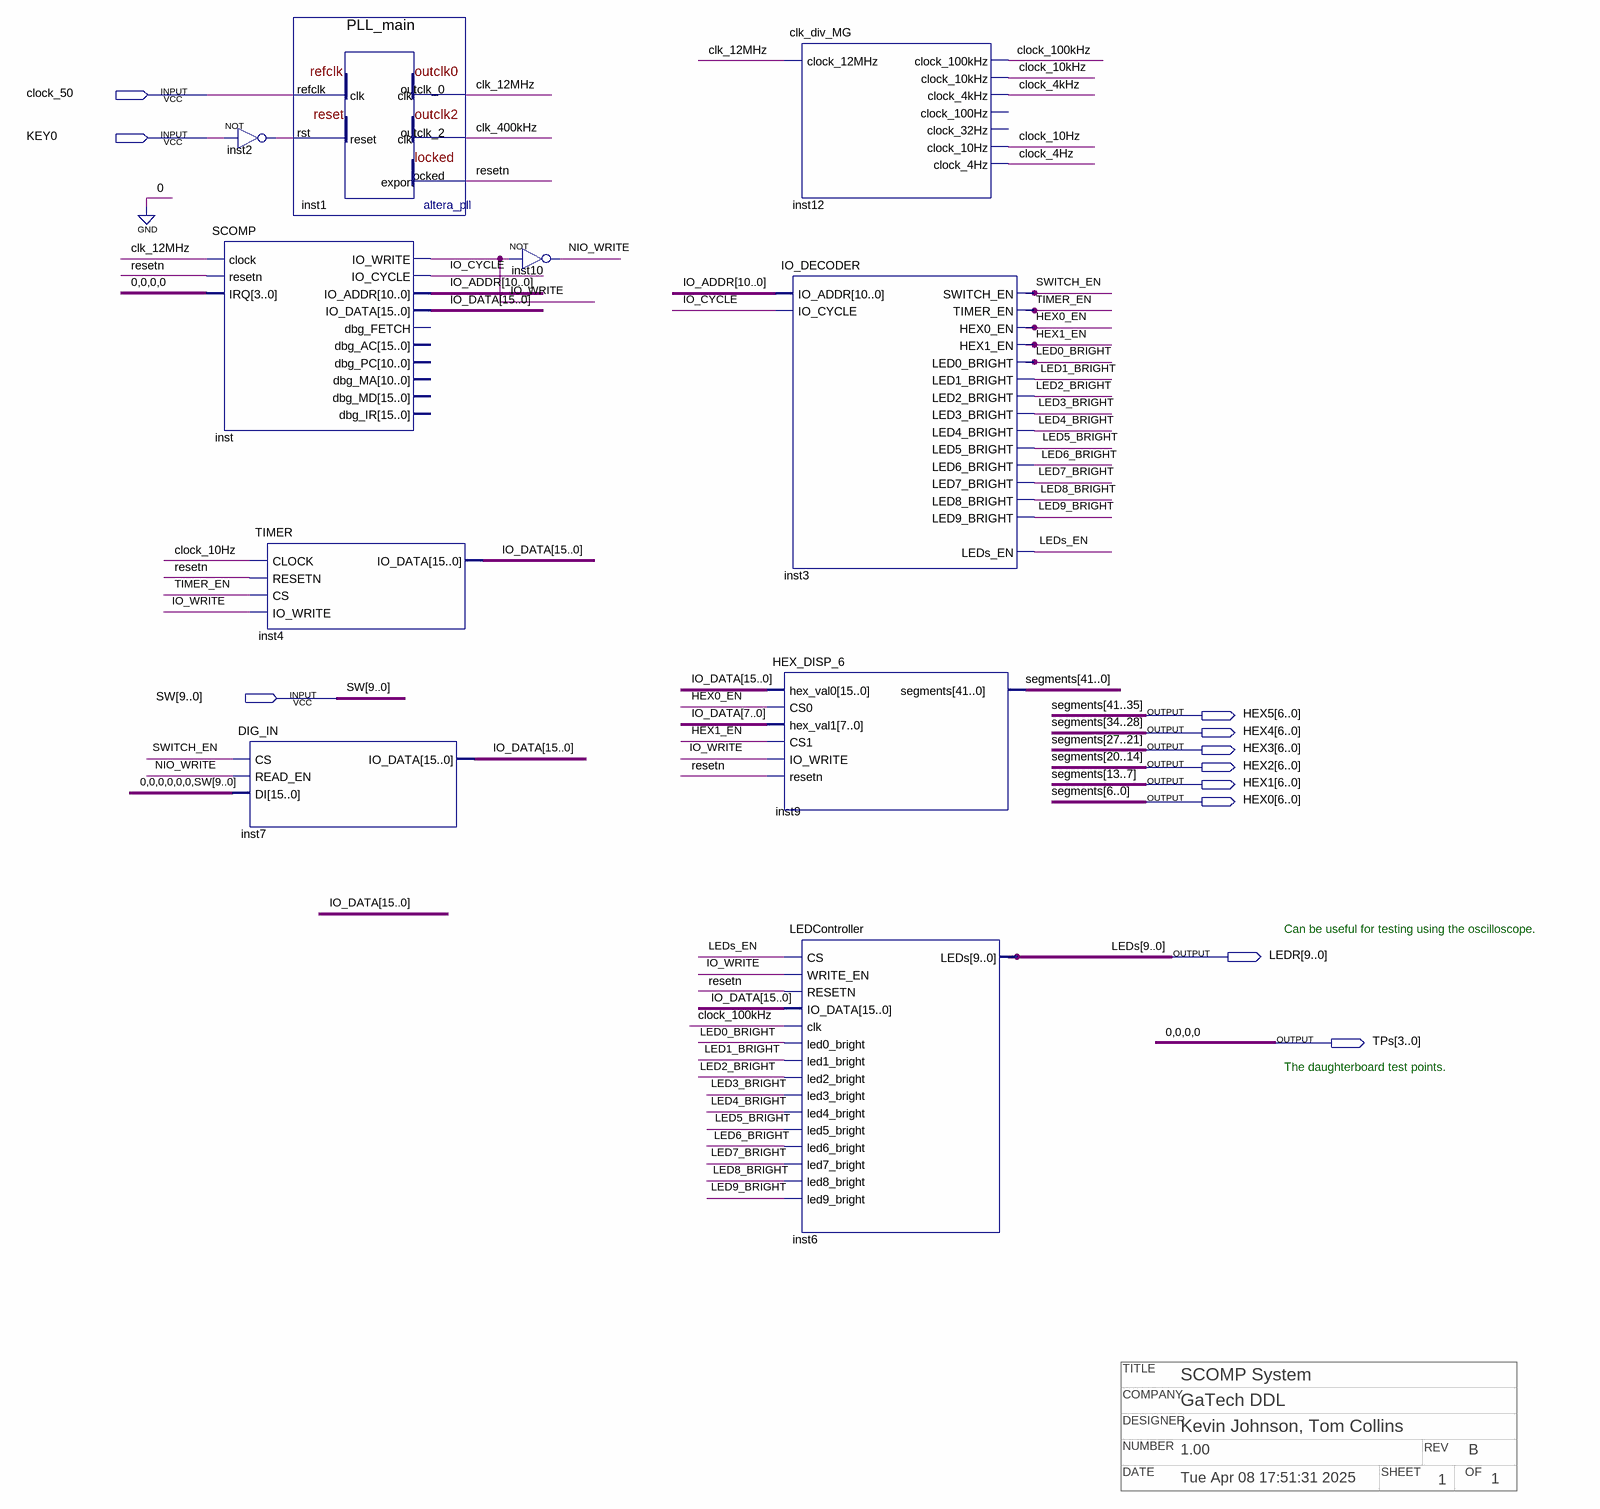
[diagram p0: schematic sheet]
// Quartus schematic SCOMP_System.bdf as structural Verilog: 10 symbols, 11 pins
// Title block: COMPANY: GaTech DDL; DATE: Tue Apr 08 17:51:31 2025; DESIGNER: Kevin Johnson, Tom Collins; NUMBER: 1.00; OF: 1; REV: B; SHEET: 1; TITLE: SCOMP System
module SCOMP_System (
  input  clock_50,
  input  KEY0,
  input  [9:0] SW,
  output [6:0] HEX5,
  output [6:0] HEX4,
  output [6:0] HEX3,
  output [6:0] HEX2,
  output [6:0] HEX1,
  output [6:0] HEX0,
  output [9:0] LEDR,
  output [3:0] TPs
);

  wire clk_12MHz, clk_400kHz, clock_4Hz, clock_4kHz, clock_10Hz, clock_10kHz, clock_100kHz, HEX0_EN, HEX1_EN,
       inst2_out, IO_CYCLE, IO_WRITE, LED0_BRIGHT, LED1_BRIGHT, LED2_BRIGHT, LED3_BRIGHT, LED4_BRIGHT,
       LED5_BRIGHT, LED6_BRIGHT, LED7_BRIGHT, LED8_BRIGHT, LED9_BRIGHT, LEDs_EN, NIO_WRITE, resetn,
       SWITCH_EN, TIMER_EN;
  wire [10:0] IO_ADDR;
  wire [15:0] IO_DATA;

  not inst2 (inst2_out, KEY0);
  SCOMP inst (
    .clock(clk_12MHz), .resetn(resetn), .IRQ(4'b0000), .IO_WRITE(IO_WRITE), .IO_CYCLE(IO_CYCLE),
    .IO_ADDR(IO_ADDR), .IO_DATA(IO_DATA));  // open: dbg_FETCH, dbg_AC, dbg_PC, dbg_MA, dbg_MD, dbg_IR
  TIMER inst4 (.CLOCK(clock_10Hz), .RESETN(resetn), .CS(TIMER_EN), .IO_WRITE(IO_WRITE), .IO_DATA(IO_DATA));
  DIG_IN inst7 (.CS(SWITCH_EN), .READ_EN(NIO_WRITE), .DI({{6{1'b0}}, SW}), .IO_DATA(IO_DATA));
  PLL_main inst1 (.refclk(clock_50), .rst(inst2_out), .outclk_0(clk_12MHz), .outclk_2(clk_400kHz), .locked(resetn));
  not inst10 (NIO_WRITE, IO_WRITE);
  clk_div_MG inst12 (
    .clock_12MHz(clk_12MHz), .clock_100kHz(clock_100kHz), .clock_10kHz(clock_10kHz), .clock_4kHz(clock_4kHz),
    .clock_10Hz(clock_10Hz), .clock_4Hz(clock_4Hz));  // open: clock_100Hz, clock_32Hz
  IO_DECODER inst3 (
    .IO_ADDR(IO_ADDR), .IO_CYCLE(IO_CYCLE), .SWITCH_EN(SWITCH_EN), .TIMER_EN(TIMER_EN), .HEX0_EN(HEX0_EN),
    .HEX1_EN(HEX1_EN), .LED0_BRIGHT(LED0_BRIGHT), .LED1_BRIGHT(LED1_BRIGHT), .LED2_BRIGHT(LED2_BRIGHT),
    .LED3_BRIGHT(LED3_BRIGHT), .LED4_BRIGHT(LED4_BRIGHT), .LED5_BRIGHT(LED5_BRIGHT),
    .LED6_BRIGHT(LED6_BRIGHT), .LED7_BRIGHT(LED7_BRIGHT), .LED8_BRIGHT(LED8_BRIGHT),
    .LED9_BRIGHT(LED9_BRIGHT), .LEDs_EN(LEDs_EN));
  HEX_DISP_6 inst9 (
    .hex_val0(IO_DATA), .CS0(HEX0_EN), .hex_val1(IO_DATA[7:0]), .CS1(HEX1_EN), .IO_WRITE(IO_WRITE),
    .resetn(resetn), .segments({HEX5, HEX4, HEX3, HEX2, HEX1, HEX0}));
  LEDController inst6 (
    .CS(LEDs_EN), .WRITE_EN(IO_WRITE), .RESETN(resetn), .IO_DATA(IO_DATA), .clk(clock_100kHz),
    .led0_bright(LED0_BRIGHT), .led1_bright(LED1_BRIGHT), .led2_bright(LED2_BRIGHT),
    .led3_bright(LED3_BRIGHT), .led4_bright(LED4_BRIGHT), .led5_bright(LED5_BRIGHT),
    .led6_bright(LED6_BRIGHT), .led7_bright(LED7_BRIGHT), .led8_bright(LED8_BRIGHT),
    .led9_bright(LED9_BRIGHT), .LEDs(LEDR));

  assign TPs = 4'b0000;

  // Other names for the same wires on the sheet: LEDs[9:0] = LEDR;
  //   segments[41:0] = {HEX5, HEX4, HEX3, HEX2, HEX1, HEX0}

  // Notes on the sheet:
  //   Can be useful for testing using the oscilloscope.
  //   The daughterboard test points.
endmodule
